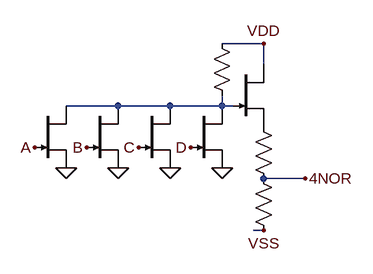
[diagram p0: schematic 4NOR.asc]
4NOR.asc, the LTspice schematic file:
Version 4.1
SHEET 1 109444 42780
WIRE -5792 -512 -5856 -512
WIRE -5792 -480 -5792 -512
WIRE -6016 -416 -6096 -416
WIRE -5936 -416 -6016 -416
WIRE -5856 -416 -5856 -432
WIRE -5856 -416 -5936 -416
WIRE -5840 -416 -5856 -416
WIRE -5728 -304 -5792 -304
WIRE -5792 -224 -5808 -224
FLAG -5792 -224 VSS
FLAG -5904 -352 D
FLAG -5728 -304 4NOR
FLAG -5856 -320 0
FLAG -5936 -320 0
FLAG -5792 -512 VDD
FLAG -6016 -320 0
FLAG -6096 -320 0
FLAG -6144 -352 A
FLAG -6064 -352 B
FLAG -5984 -352 C
SYMBOL res -5872 -528 R0
WINDOW 0 -35 57 Invisible 2
WINDOW 3 34 56 Invisible 2
SYMATTR InstName R3475
SYMATTR Value 100k
SYMBOL njf -5840 -480 R0
WINDOW 0 56 32 Invisible 2
WINDOW 3 56 72 Invisible 2
SYMATTR InstName J_F885
SYMATTR Value DR
SYMBOL res -5808 -400 R0
WINDOW 0 -24 60 Invisible 2
WINDOW 3 34 58 Invisible 2
SYMATTR InstName R3476
SYMATTR Value 1k
SYMBOL res -5808 -320 R0
WINDOW 0 -22 62 Invisible 2
WINDOW 3 37 62 Invisible 2
SYMATTR InstName R3477
SYMATTR Value 4.8k
SYMBOL njf -5904 -416 R0
WINDOW 0 56 32 Invisible 2
WINDOW 3 56 72 Invisible 2
SYMATTR InstName J_B1004
SYMATTR Value DR
SYMBOL njf -5984 -416 R0
WINDOW 0 56 32 Invisible 2
WINDOW 3 56 72 Invisible 2
SYMATTR InstName J_B1
SYMATTR Value DR
SYMBOL njf -6064 -416 R0
WINDOW 0 56 32 Invisible 2
WINDOW 3 56 72 Invisible 2
SYMATTR InstName J_B2
SYMATTR Value DR
SYMBOL njf -6144 -416 R0
WINDOW 0 56 32 Invisible 2
WINDOW 3 56 72 Invisible 2
SYMATTR InstName J_B3
SYMATTR Value DR

The netlist it stands for:
* 4NOR.asc
R3475 VDD N001 100k
J_F885 VDD N001 P001 DR
R3476 P001 4NOR 1k
R3477 4NOR VSS 4.8k
J_B1004 N001 D 0 DR
J_B1 N001 C 0 DR
J_B2 N001 B 0 DR
J_B3 N001 A 0 DR
.model NJF NJF
.model PJF PJF
.lib standard.jft
.backanno
.end